# Altium schematic sheet Arduino_Uno_Kit.SchDoc: ARDUINO UNO KIT
size A3; Author: Giuseppe Pinto; CompanyName: Arduino; Engineer: Giuseppe Pinto; DocumentNumber: ASX_00040; Revision: V 1.0; SheetNumber: 1; SheetTotal: 1; RevAuthor: Giuseppe Pinto
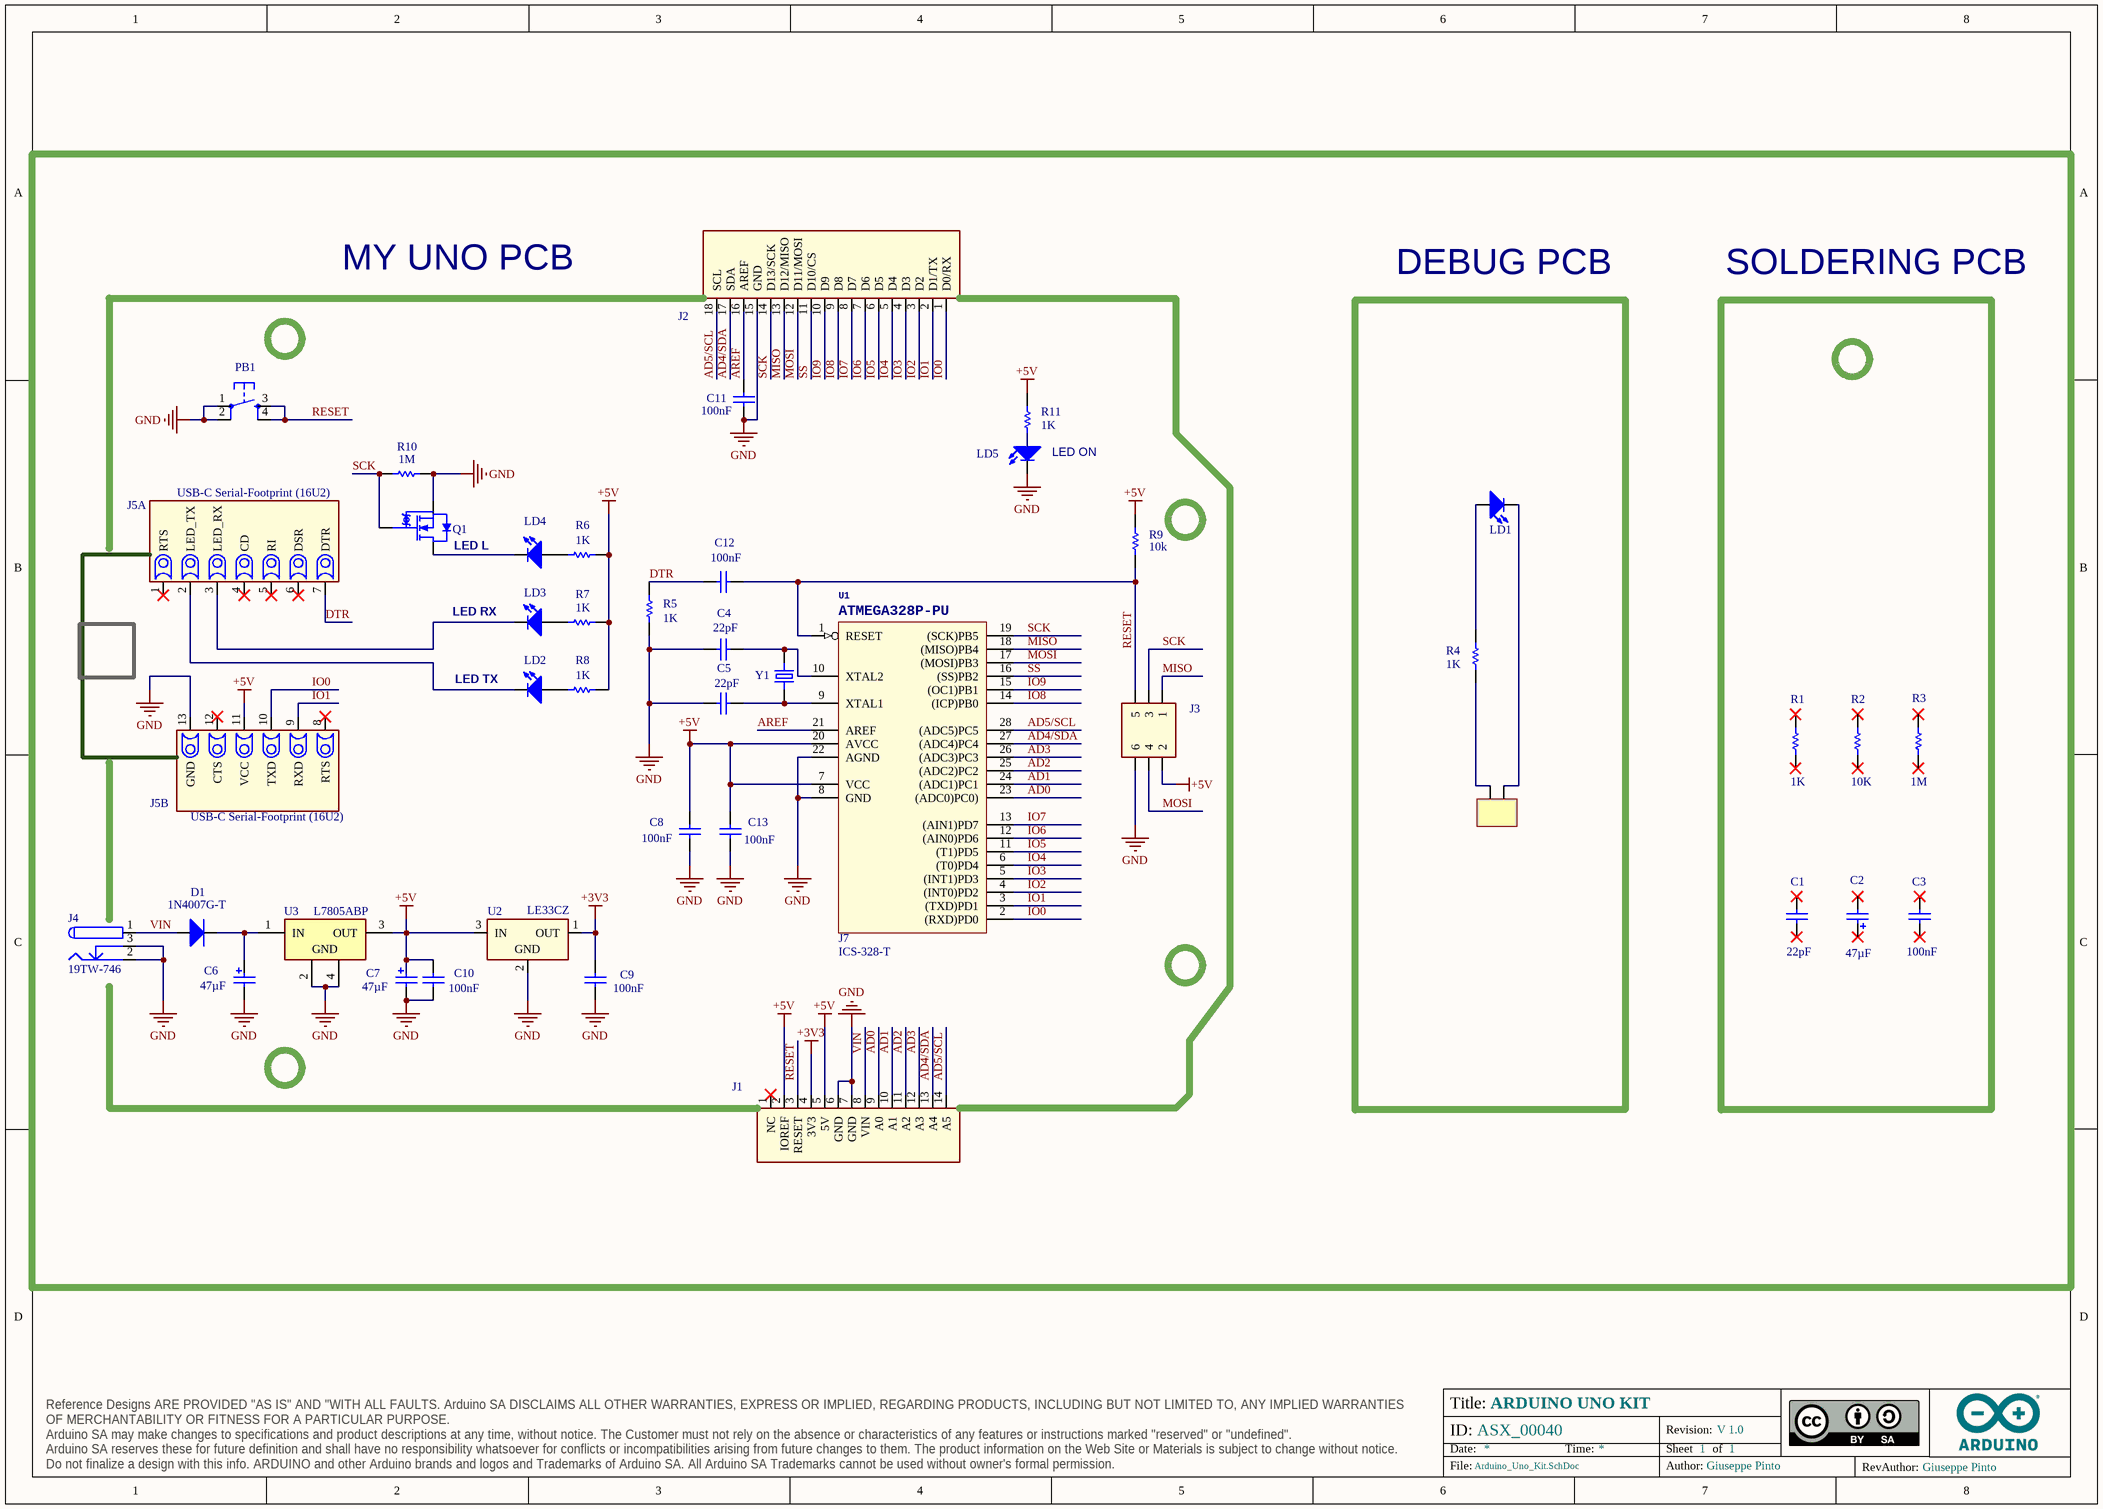
[diagram p0: Arduino_Uno_Kit.SchDoc]

## Parts
C1  value 22pF  [TS170R1H220JSANB0R]  (hidden comment: TS170R1H220JSANB0R)
C2  value 47µF  [EKF476M1EE05TU]  (hidden comment: EKF476M1EE05TU)
C3  value 100nF  [B32529C0104J289]  (hidden comment: B32529C0104J289)
C4  value 22pF  [TS170R1H220JSANB0R]  (hidden comment: TS170R1H220JSANB0R)
C5  value 22pF  [TS170R1H220JSANB0R]  (hidden comment: TS170R1H220JSANB0R)
C6  value 47µF  [EKF476M1EE05TU]  (hidden comment: EKF476M1EE05TU)
C7  value 47µF  [EKF476M1EE05TU]  (hidden comment: EKF476M1EE05TU)
C8  value 100nF  [B32529C0104J289]  (hidden comment: B32529C0104J289)
C9  value 100nF  [B32529C0104J289]  (hidden comment: B32529C0104J289)
C10  value 100nF  [B32529C0104J289]  (hidden comment: B32529C0104J289)
C11  value 100nF  [B32529C0104J289]  (hidden comment: B32529C0104J289)
C12  value 100nF  [B32529C0104J289]  (hidden comment: B32529C0104J289)
C13  value 100nF  [B32529C0104J289]  (hidden comment: B32529C0104J289)
D1  1N4007G-T  [1N4007G-T-Footprint-1]
J1  20TW-995  [1X14-CUSTOM]  (value not drawn)
J2  20TW-994  [1X18-CUSTOM]  (value not drawn)
J3  PH2-06-UA  [2X03]  (value not drawn)
J4  19TW-746  [POWERSUPPLY_DC-21MM]
J5  USB-C Serial-Footprint (16U2)  [USB-C Serial-Footprint (16U2)]  (parts A,B of 2)  (no BOM)
J6  MK125002GO  [MK125002GO]  (value not drawn)
J7  ICS-328-T  [ICS-328-T-Footprint-1]
LD1  L-7104YD  [L314YD-Footprint-1]  (value not drawn)
LD2  L-7104YD  [L314YD-Footprint-1]  (value not drawn)
LD3  L-7104YD  [L314YD-Footprint-1]  (value not drawn)
LD4  L-7104YD  [L314YD-Footprint-1]  (value not drawn)
LD5  L-7104GD  [L314YD-Footprint-1]  (value not drawn)
PB1  TS21043-160B-5227260  [SW6X6]  (value not drawn)
Q1  2N7000BU  [SOT23]  (value not drawn)
R1  value 1K  [A5215]  (hidden comment: 2-1623930-9)
R2  value 10K  [A5213]  (hidden comment: 0-1623930-3)
R3  value 1M  [A5217]  (hidden comment: 3-1623930-5)
R4  value 1K  [A5215]  (hidden comment: 2-1623930-9)
R5  value 1K  [A5215]  (hidden comment: 2-1623930-9)
R6  value 1K  [A5215]  (hidden comment: 2-1623930-9)
R7  value 1K  [A5215]  (hidden comment: 2-1623930-9)
R8  value 1K  [A5215]  (hidden comment: 2-1623930-9)
R9  value 10k  [A5213]  (hidden comment: 0-1623930-3)
R10  value 1M  [A5217]  (hidden comment: 3-1623930-5)
R11  value 1K  [A5215]  (hidden comment: 2-1623930-9)
U1  ATMEGA328P-PU  [DIL28-3]
U2  LE33CZ  [LE33CZ-TR/AP]
U3  L7805ABP  [TO220]
Y1  ECS-160-20-4X-DU  [ECS-160-20-4X-DU-Footprint-1]  (value not drawn)

## Blocks framed on the sheet
MY UNO PCB: C4-C13 D1 J1-J5 J7 LD2-LD5 PB1 Q1 R5-R11 U1-U3 Y1
DEBUG PCB: J6 LD1 R4
SOLDERING PCB: C1-C3 R1-R3

## Nets
+3V3: C9.1 J1.4(3V3) U2.1(OUT)
+5V: C7.2 C8.1 C10.1 C13.1 J1.2(IOREF) J1.5(5V) J3.2 J5.11(VCC) R6.1 R7.1 R8.1 R9.2 R11.1 U1.7(VCC) U1.20(AVCC) U2.3(IN) U3.3(OUT)
GND: C4.2 C5.2 C6.1 C7.1 C8.2 C9.2 C10.2 C11.2 C13.2 J1.6(GND) J1.7(GND) J2.15(GND) J3.6 J4.2 J4.3 J5.13(GND) LD5.C PB1.1 PB1.2 Q1.1(S) R5.2 R10.2 U1.8(GND) U1.22(AGND) U2.2(GND) U3.2(GND) U3.4(GND)
AD0: J1.9(A0) U1.23((ADC0)PC0))
AD1: J1.10(A1) U1.24((ADC1)PC1)
AD2: J1.11(A2) U1.25((ADC2)PC2)
AD3: J1.12(A3) U1.26((ADC3)PC3)
AD4/SDA: J1.13(A4) J2.17(SDA) U1.27((ADC4)PC4)
AD5/SCL: J1.14(A5) J2.18(SCL) U1.28((ADC5)PC5)
AREF: C11.1 J2.16(AREF) U1.21(AREF)
DTR: C12.2 J5.7(DTR) R5.1
IO0: J2.1(D0/RX) J5.10(TXD) U1.2((RXD)PD0)
IO1: J2.2(D1/TX) J5.9(RXD) U1.3((TXD)PD1)
IO2: J2.3(D2) U1.4((INT0)PD2)
IO3: J2.4(D3) U1.5((INT1)PD3)
IO4: J2.5(D4) U1.6((T0)PD4)
IO5: J2.6(D5) U1.11((T1)PD5)
IO6: J2.7(D6) U1.12((AIN0)PD6)
IO7: J2.8(D7) U1.13((AIN1)PD7)
IO8: J2.9(D8) U1.14((ICP)PB0)
IO9: J2.10(D9) U1.15((OC1)PB1)
MISO: J2.13(D12/MISO) J3.1 U1.18((MISO)PB4)
MOSI: J2.12(D11/MOSI) J3.4 U1.17((MOSI)PB3)
RESET: C12.1 J1.3(RESET) J3.5 PB1.3 PB1.4 R9.1 U1.1(RESET)
SCK: J2.14(D13/SCK) J3.3 Q1.2(G) R10.1 U1.19((SCK)PB5)
SS: J2.11(D10/CS) U1.16((SS)PB2)
VIN: D1.1 J1.8(VIN) J4.1
NetC4_1: C4.1 U1.10(XTAL2) Y1.2
NetC5_1: C5.1 U1.9(XTAL1) Y1.1
NetC6_2: C6.2 D1.2 U3.1(IN)
NetJ5_2: J5.2(LED_TX) LD2.C
NetJ5_3: J5.3(LED_RX) LD3.C
NetJ6_1: J6.1 R4.1
NetJ6_2: J6.2 LD1.C
NetLD1_A: LD1.A R4.2
NetLD2_A: LD2.A R8.2
NetLD3_A: LD3.A R7.2
NetLD4_A: LD4.A R6.2
NetLD4_C: LD4.C Q1.3(D)
NetLD5_A: LD5.A R11.2

Not connected (* = marked no-connect by the designer): C1 1* 2*; C2 1* 2*; C3 1* 2*; J1 1(NC)*; J5 1(RTS)* 4(CD)* 5(RI)* 6(DSR)* 8(RTS)* 12(CTS)*; R1 1* 2*; R2 1* 2*; R3 1* 2*

## Notes on the sheet
- LED ON
- (near Q1) LED L
- (near LD3) LED RX
- (near LD2) LED TX
- Title:
- ID:
- Date:
- Time:
- Revision:
- Sheet
- of
- RevAuthor:
- Reference Designs ARE PROVIDED "AS IS" AND "WITH ALL FAULTS. Arduino SA DISCLAIMS ALL OTHER WARRANTIES, EXPRESS OR IMPLIED, REGARDING PRODUCTS, INCLUDING BUT NOT LIMITED TO, ANY IMPLIED WARRANTIES OF MERCHANTABILITY OR FITNESS FOR A PARTICULAR PURPOSE.
  Arduino SA may make changes to specifications and product descriptions at any time, without notice. The Customer must not rely on the absence or characteristics of any features or instructions marked "reserved" or "undefined".
  Arduino SA reserves these for future definition and shall have no responsibility whatsoever for conflicts or incompatibilities arising from future changes to them. The product information on the Web Site or Materials is subject to change without notice.
  Do not finalize a design with this info. ARDUINO and other Arduino brands and logos and Trademarks of Arduino SA. All Arduino SA Trademarks cannot be used without owner's formal permission.
- File:
- Author:

## Library data of the parts
C1 C4 C5 = C0124-A.13: CAP THD 22pF 50V C0G 5%; Manufacturer: Suntan; Code Arduino: C0124; Part Number: TS170R1H220JSANB0R; Package: P : 5.08 Ammo; Voltage: 50V; Tolerance: 5%
C2 C6 C7 = C0125-A.8: CAP ALUM POL THD 47uF 25V; Manufacturer: SAMXON; Tolerance: 20%; Code Arduino: C0125; Manufacturer Part Number 2: EKF476M1EE05TU; Package: 6.3x5mm  P. 2.5mm; Voltage: 25V; Part Number: EKF476M1EE05TU
C3 C8-C13 = C0127-A.6: CAP THD 100NF 63V POLIESTER; Manufacturer: EPCOS; Code Arduino: 0080; Tolerance: 5%; Part Number: B32529C0104J289; Voltage: 63V
D1 = D0054-A.4: Diodes [1N4007]; Manufacturer: Panjit; Code Arduino: 0066; Voltage Rating (DC): 1kV; Part Number: 1N4007G-T
J1 = J0063-A.5: CONN STRIP F/1/D 14v SER.NERA s1pin; Code Arduino: 3649; Pin Count: 14; Part Number: 20TW-995
J2 = J0035-A.8: CONN STRIP F/1/D 18v SER.NERA s1pin; Code Arduino: 3648; Part Number: 20TW-994
J3 = J0004-A.4: CONN Header Through Hole 6 position 0.100" (2.54mm); Manufacturer: Adam Tech; Code Arduino: 0114; Part Number: PH2-06-UA
J4 = J0236-A.3: CONN PWR JACK 2.1X5.5MM SOLDER; Manufacturer: 4UCON; Code Arduino: 0018; Part Number: 19TW-746
J5 = AF0006-A.8: Pin Count: 13; Design Item ID: AF0006
J6 = J0012-A.7: CONN MORS.CS 2v p3,5 10A aLING.VER; Manufacturer: Adimpex; Code Arduino: 2341; Manufacturer 2: 4U CON; Manufacturer Part Number 2: 19TW-974; Part Number: MK125002GO
J7 = J0044-A.1: CONN DIP 28 SOCKET; Manufacturer: Adam Tech; Code Arduino: 0064; Pitch: 2.54mm; Pin Count: 0; Lead Free: Lead Free; Part Number: ICS-328-T; Mount: Through Hole; Contact Plating: Copper,Tin
LD1-LD4 = L0021-A.7: LED THD YELLOW DIFFUSED T-1, 3mm; Manufacturer: Kingbright; Code Arduino: L0021; Part Number: L-7104YD
LD5 = L0023-A.5: LED THD GREEN DIFFUSED T-1, 3mm; Manufacturer: Kingbright; Code Arduino: L0023; Part Number: L-7104GD
PB1 = B0002-A.6: PUSHBUTTON.6x6 CS Hatt0,7 NERO 160g; Code Arduino: 0089; Part Number: TS21043-160B-5227260
Q1 = T0035-A.6: TRANSISTOR NMOS SMALL SIGNAL EFFECT 0.2A I(D) 1-ELEMENT; Manufacturer: Onsemi; Drain to Source Breakdown Voltage: 60V; Code Arduino: T0035; Rds On Max: 1.2; Device Type: Mosfet N-CH SMD; Part Number: 2N7000BU; Pin Count: 3
R1 R4-R8 R11 = R0221-A.13: RES FIXED THD 1K OHM 1/4W 5%; Manufacturer: TE connectivity; Power: 250mW; Tolerance: 5%; Code Arduino: A5215; Part Number: 2-1623930-9
R2 R9 = R0226-A.10: RES THD 10K 1/4W 5%; Manufacturer: TE connectivity; Power: 250mW; Tolerance: 5%; Code Arduino: A5213; Part Number: 0-1623930-3
R3 R10 = R0227-A.11: RES THD 1M OHM 1/4w  5%; Manufacturer: TE Connectivity; Power: 250mW; Tolerance: 5%; Code Arduino: A5217; Part Number: 3-1623930-5
U1 = U0038-A.2: IC MICROCONTROLLER ATMEGA328P-PU; Manufacturer: Microchip; Device Type: MCU; Pin Count: 28; Code Arduino: ATMEGA328P-PU; Part Number: ATMEGA328P-PU
U2 = U0246-A.6: IC REG LDO FIXED 3.3V, 0.2V DROPOUT TO-92-3; Manufacturer: STMicroelectronics; Power Supply Rejection Ratio (PSRR): 80db; Number of Outputs: 1; Max Input Voltage: 18V; Code Arduino: U0246; Polarity: Positive; Dropout Voltage: 2V; Max Output Current: 100mA; Quiescent Current: 1mA; Tolerance: 1%; Output Voltage: 3v3; Weight: 0.08113oz; Lead Free: Lead Free; Max Operating Temperature: 125°C; Number of Regulators: 1; Length: 10.4mm; Part Number: LE33CZ-TR/AP; Case/Package: TO-92-3; Min Operating Temperature: - 40 C; Width: 4.6mm; Mount: Through Hole; Packaging: Rail/Tube; Output Configuration: Positive; Number of Pins: 3; RoHS Certificate: SI; Output Current: 100mA; Radiation Hardening: No; Output Type: Fixed; REACH SVHC: No SVHC; Nominal Output Voltage: 3V3; RoHS Compliance: SI
U3 = U0239-A.4: IC REG LINEAR 5V 1.5A TO220AB; Manufacturer: STMicroelectronics; Output Configuration: Positive; Number of Regulators: 1; Max Input Voltage: 25V; Quiescent Current: 8mA; Tolerance: 5%; Min Input Voltage: 7V; Dropout Voltage: 2V; Output Type: Fixed; Power Supply Rejection Ratio (PSRR): 62dB; Code Arduino: U0239; Mount: Through Hole; Height: 9.15mm; Radiation Hardening: No; Weight: 0.08113oz; Number of Outputs: 1; Max Output Current: 1.5A; Packaging: Rail/Tube; Case/Package: TO-220FP; Min Output Voltage: 5V; Package Quantity: 1000; Length: 10.4mm; Contact Plating: Gold; Nominal Output Voltage: 5V; Lead Free: Lead Free; Polarity: Positive; Width: 4.6mm; REACH SVHC: No SVHC; Number of Pins: 2; Output Current: 1.5A; Min Operating Temperature: 0°C; Max Operating Temperature: 125°C; Output Voltage: 5V; Part Number: L7805ABP
Y1 = X0004-A.3: CRYSTAL 16.0000MHZ 20PF THD; Manufacturer: ECS; Code Arduino: 0019; Part Number: ECS-160-20-4X-DU